# EAGLE design DCDCDC (EAGLE 9.1.3)
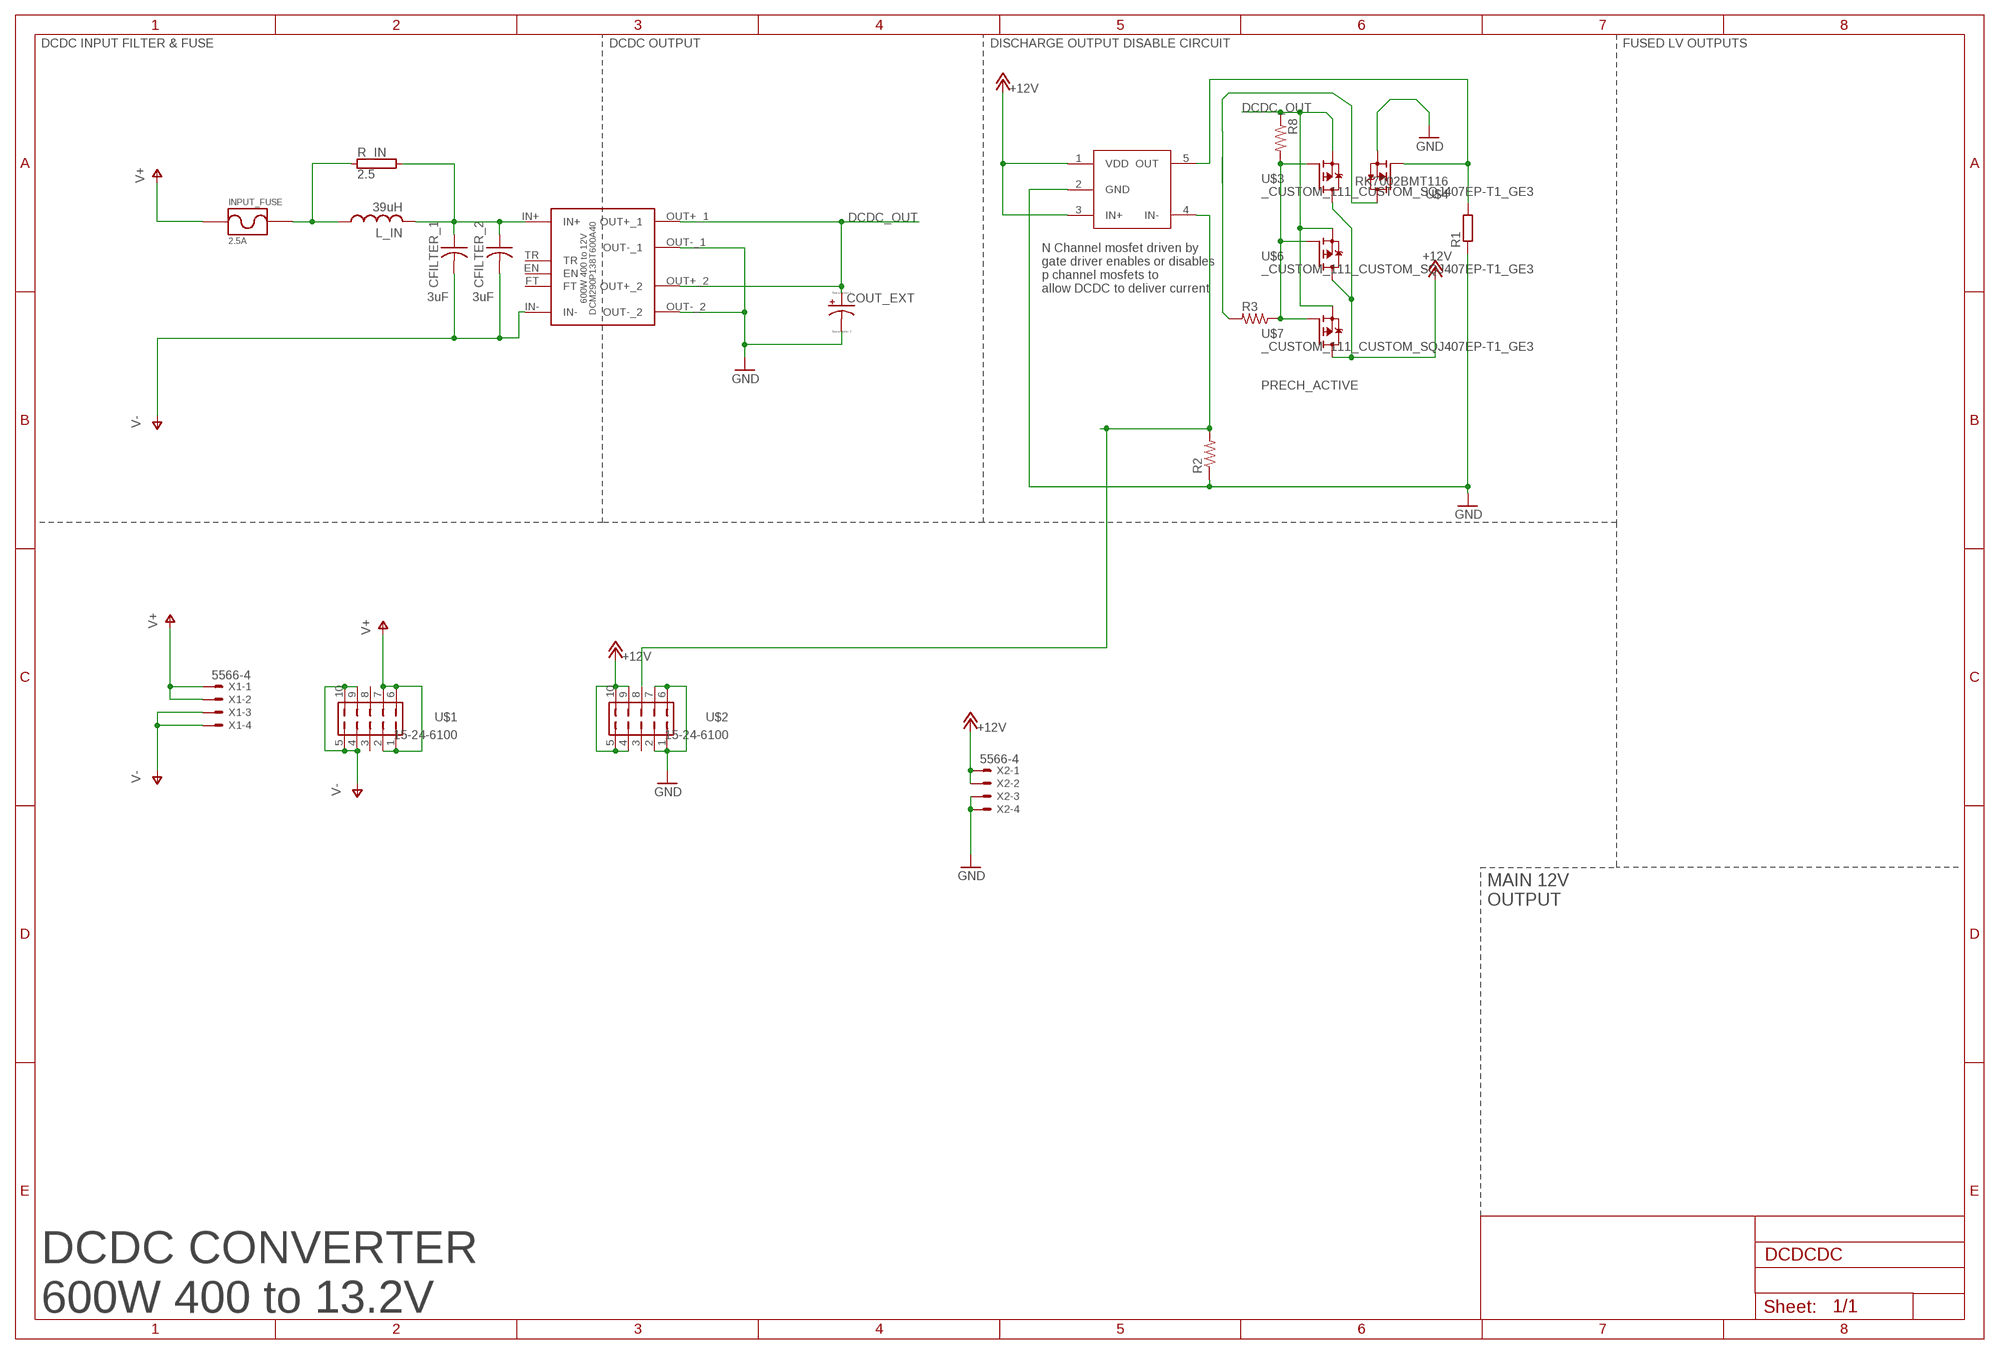
[diagram p0: schematic, sheet 1]

## Parts
CFILTER_1  3uF  B58035U5305M062  [CERALINK_FA3]
CFILTER_2  3uF  B58035U5305M062  [CERALINK_FA3]
COUT_EXT  CPOL-USE7.5-16  [E7,5-16]
DCM290P138T600A40  600W 400 to 12V  VICOR_CHIP_WITH_HEATSINK  [VICOR_CHIP_HEATSINK]
INPUT_FUSE  2.5A  _CUSTOM_PARTS_LF_885  [_CUSTOM_PARTS_LF_885]
L_IN  39uH  SRP1770TA-390M  [L_1510_NONSTANDARD]
R1  R-EU_R0805  [R0805]
R2  R-US_R0805  [R0805]
R3  R-US_R0805  [R0805]
R8  R-US_R0805  [R0805]
R_IN  2.5  RMG100-V  [TO-247-2V]
U$1  15-24-6100  [15-24-6100]
U$2  15-24-6100  [15-24-6100]
U$3  _CUSTOM_111_CUSTOM_SQJ407EP-T1_GE3  [_CUSTOM_111_CUSTOM_TRANS_SIRA90DP-T1-GE3]
U$4  RK7002BMT116  [SOT23]
U$5  UCC27511AQDBVRQ1  [SOT23-5L]
U$6  _CUSTOM_111_CUSTOM_SQJ407EP-T1_GE3  [_CUSTOM_111_CUSTOM_TRANS_SIRA90DP-T1-GE3]
U$7  _CUSTOM_111_CUSTOM_SQJ407EP-T1_GE3  [_CUSTOM_111_CUSTOM_TRANS_SIRA90DP-T1-GE3]
X1  5566-4  [5566-4]
X2  5566-4  [5566-4]

## Nets
+12V: U$2.4 U$2.5 U$2.9 U$2.10 U$3.5(D) U$5.1(VDD) U$5.3(IN+) U$6.5(D) U$7.5(D) X2.1 X2.2
DCDC_OUT: COUT_EXT.+ DCM290P138T600A40.OUT+_1 DCM290P138T600A40.OUT+_2 R8.1 U$3.1(S) U$3.2(S) U$3.3(S) U$6.1(S) U$6.2(S) U$6.3(S) U$7.1(S) U$7.2(S) U$7.3(S)
GND: COUT_EXT.- DCM290P138T600A40.OUT-_1 DCM290P138T600A40.OUT-_2 R1.1 R2.1 U$2.1 U$2.2 U$2.6 U$2.7 U$4.2(S) U$5.2(GND) X2.3 X2.4
N$1: R3.1 R8.2 U$3.4(G) U$6.4(G) U$7.4(G)
N$2: R1.2 U$4.1(G) U$5.5(OUT)
N$3 [LV]: CFILTER_1.P$1 CFILTER_2.P$1 DCM290P138T600A40.IN+ L_IN.P$2 R_IN.2
N$4: R3.2 U$4.3(D)
PRECH_ACTIVE: R2.2 U$2.8 U$5.4(IN-)
V+ [LV]: INPUT_FUSE.P$1 U$1.1 U$1.2 U$1.6 U$1.7 X1.1 X1.2
V+_FUSED [LV]: INPUT_FUSE.P$2 L_IN.P$1 R_IN.1
V- [LV]: CFILTER_1.P$2 CFILTER_2.P$2 DCM290P138T600A40.IN- U$1.4 U$1.5 U$1.9 U$1.10 X1.3 X1.4
Unconnected: DCM290P138T600A40.EN DCM290P138T600A40.FT DCM290P138T600A40.TR U$1.3 U$1.8 U$2.3

## Notes on the sheet
- DCDC INPUT FILTER & FUSE | DCDC OUTPUT | DISCHARGE OUTPUT DISABLE CIRCUIT | FUSED LV OUTPUTS
- N Channel mosfet driven by 
  gate driver enables or disables 
  p channel mosfets to 
  allow DCDC to deliver current
- MAIN 12V
  OUTPUT
- DCDC CONVERTER 
  600W 400 to 13.2V

## Library data of the parts
CFILTER_1 CFILTER_2 = ACC-MB-R0:B58035U5305M062
COUT_EXT = ACC-MB-R0:CPOL-US: POLARIZED CAPACITOR, American symbol
DCM290P138T600A40 = ACC-MB-R0:VICOR_CHIP_WITH_HEATSINK
INPUT_FUSE = ACC-MB-R0:_CUSTOM_PARTS_LF_885
L_IN = ACC-MB-R0:SRP1770TA-390M
R1 = ACC-MB-R0:R-EU_: RESISTOR, European symbol; SPICEPREFIX: R
R2 R3 R8 = ACC-MB-R0:R-US_: RESISTOR, American symbol; SPICEPREFIX: R
R_IN = ACC-MB-R0:RMG100: TO-247 Power Resistor - RMG 100 Series Source: www.token.com.tw .. power-resistor-rmg100pdf; OC_FARNELL: unknown; OC_NEWARK: unknown
U$1 U$2 = ACC-MB-R0:15-24-6100
U$3 U$6 U$7 = ACC-MB-R0:_CUSTOM_111_CUSTOM_SQJ407EP-T1_GE3
U$4 = ACC-MB-R0:RK7002BMT116
U$5 = ACC-MB-R0:UCC27511AQDBVRQ1
X1 X2 = ACC-MB-R0:5566-4: Mini FIT connector 4 pol Source: http://www.molex.com; MF: MOLEX; OC_FARNELL: unknown; OC_NEWARK: unknown

## Net classes
0 default: width 1 mm, clearance 0.152 mm
1 LV: clearance 0.001 mm

## Board
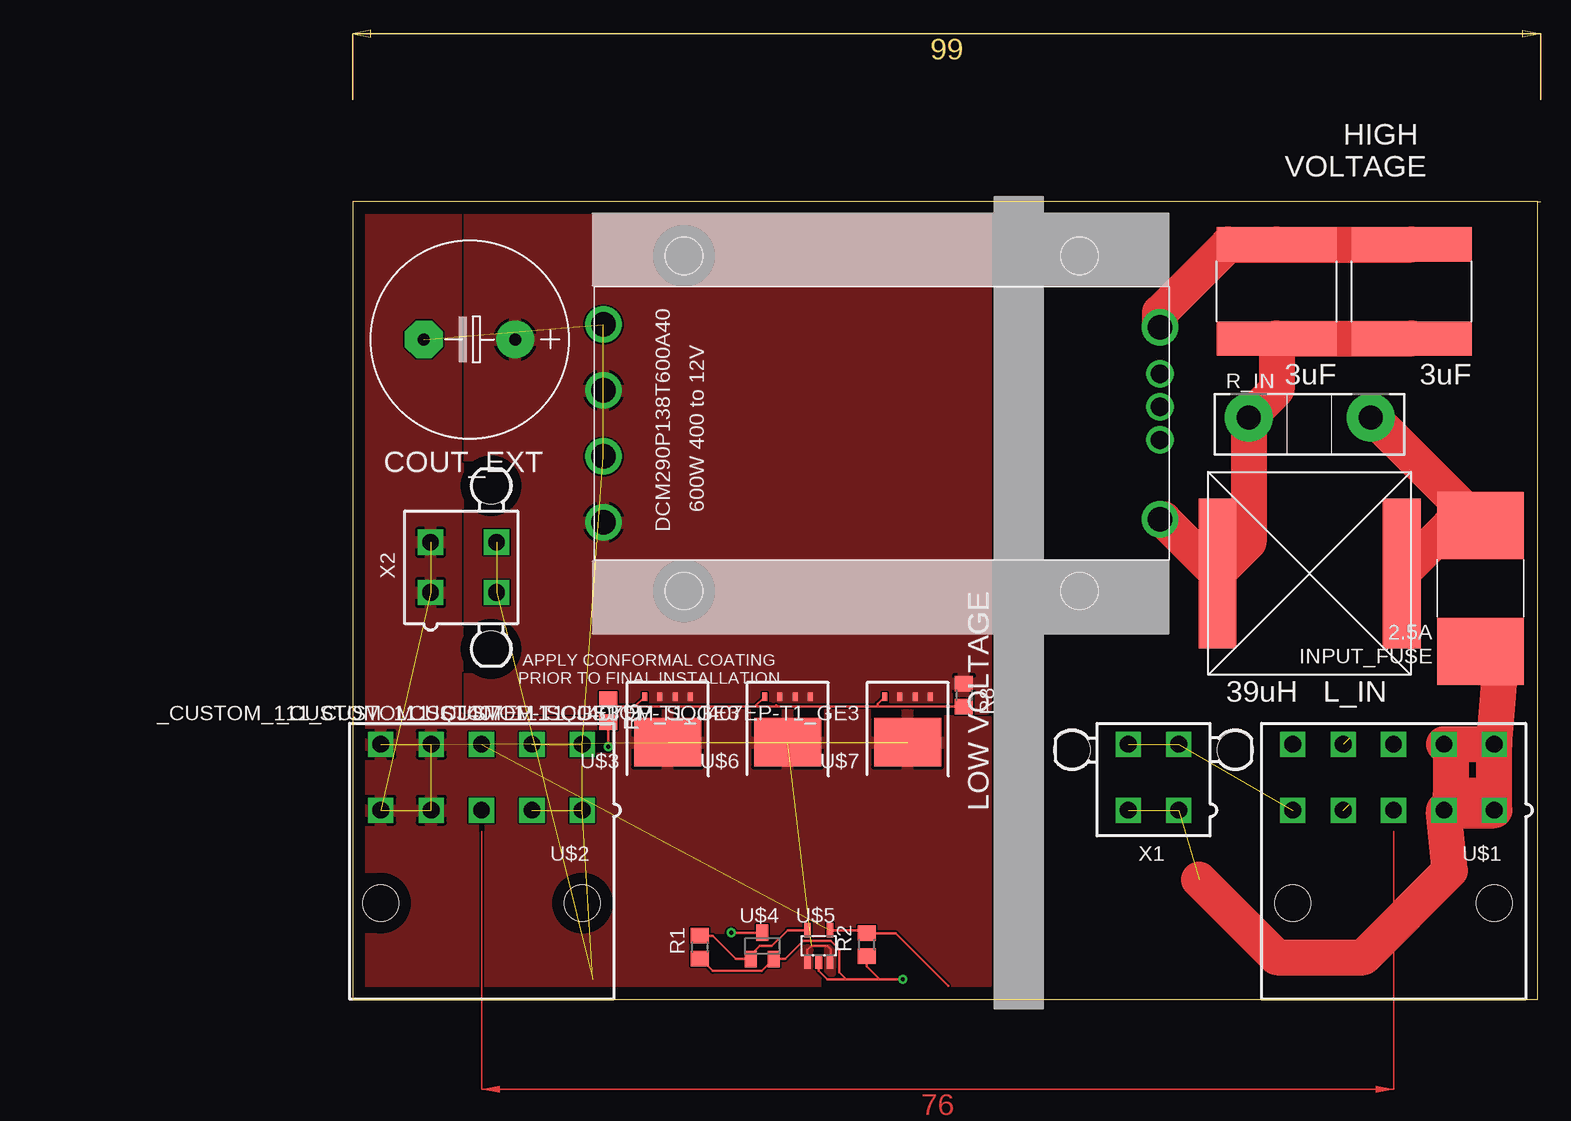
[diagram p1: board, top side]
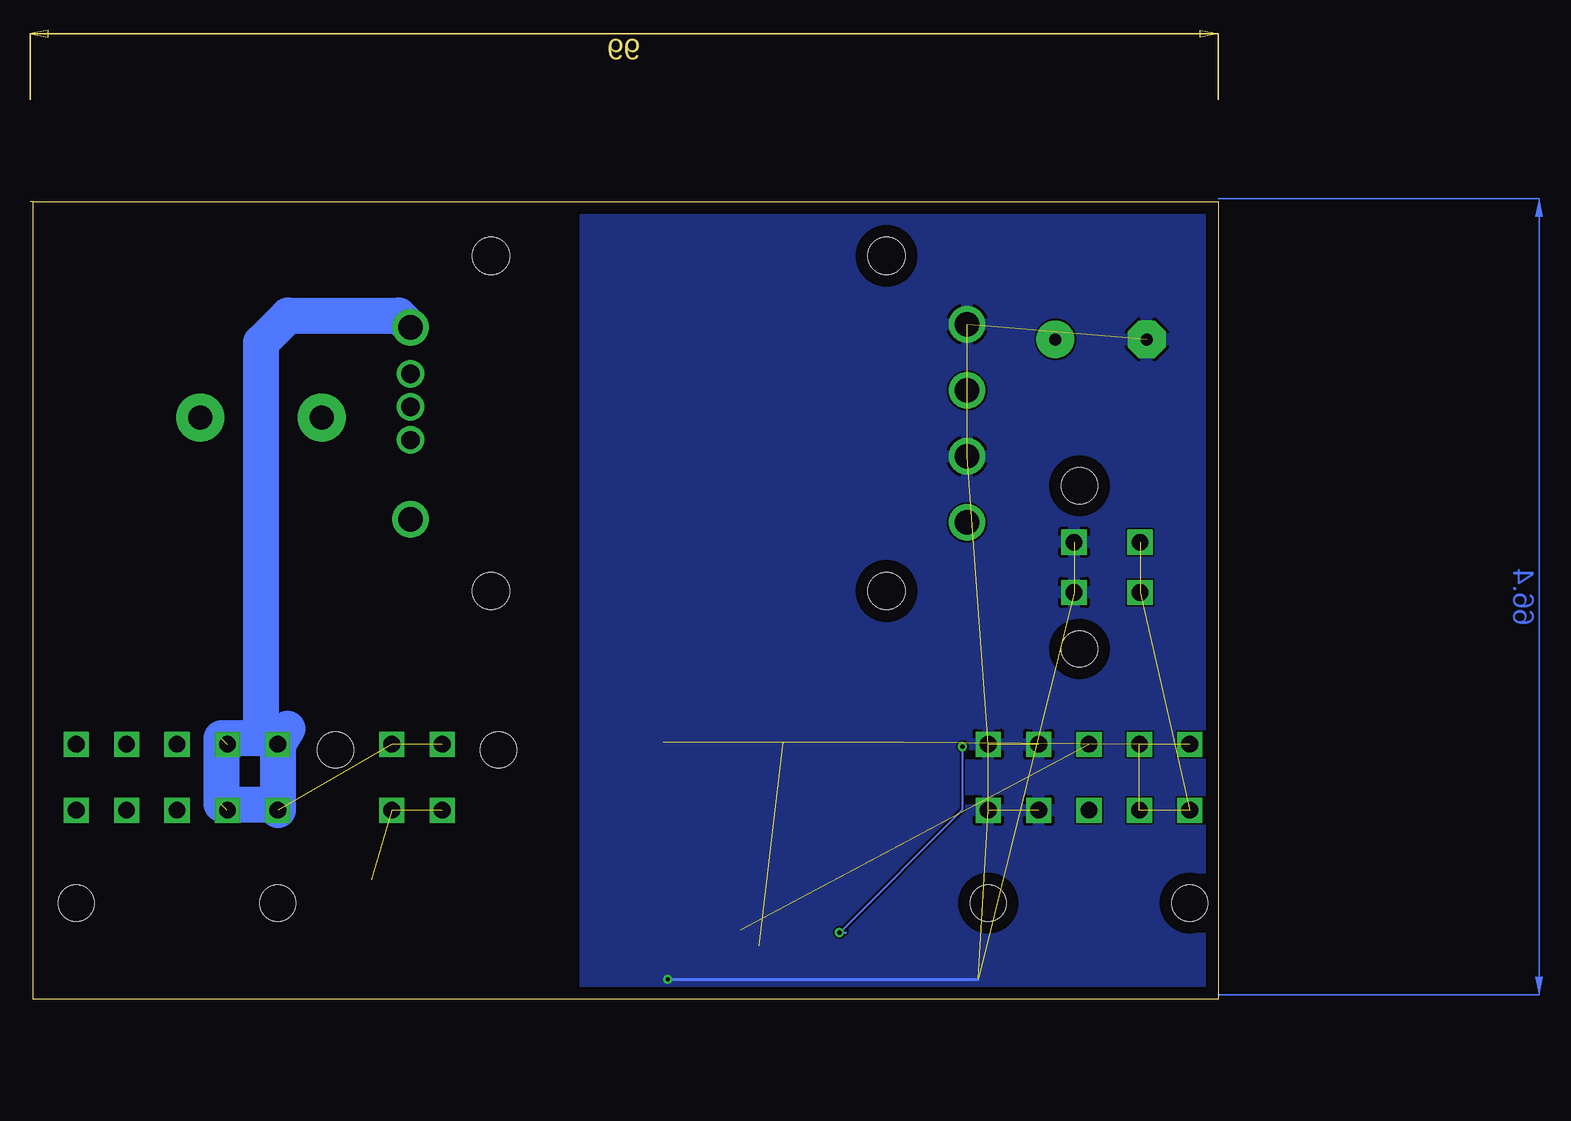
[diagram p2: board, bottom side, seen from below]

Size 99 x 66.5 mm. Coordinates in mm from the lower left corner, seen from the top.
Outline: 98.75,66.5 0,66.5 0,0 98.75,0 98.75,66.5
Outline: 98.75,66.5 99,66.5
Copper layers (1*16): Top 0.035mm / dielectric 1.5mm / Bottom 0.035mm
Design rules "default": minimum track width 6mil, minimum drill 0.35mm, track to track 6mil, track to pad 6mil, pad to pad 6mil, via to via 6mil, smd to smd 6mil, copper to edge 40mil, drill to drill 6mil, minimum pad ring 10mil, minimum via ring 8mil, stop-mask expansion 4mil, vias tented up to drill 0mil, thermal gap 10mil

### Footprints (pad centres in the part's own frame; a part is rotated, then mirrored left to right if it is on the bottom)
CERALINK_FA3 = smd 2.85 x 10: P$1 -3.925,0; P$2 3.925,0
E7,5-16 = drill 1.016 pad 3.15: + -3.81,0 | drill 1.016 pad 3.15 octagon: - 3.81,0
VICOR_CHIP_HEATSINK = drill 1.52 pad 1.77: EN -23.19,-1.38; FT -23.19,-4.13; TR -23.19,1.38 | drill 2.03 pad 2.28: IN+ -23.19,8; IN- -23.19,-8 | drill 2.03 pad 2.41: OUT+_1 23.19,8.25; OUT+_2 23.19,-2.75; OUT-_1 23.19,2.75; OUT-_2 23.19,-8.25 | hole 3.1: -16.47,13.97; -16.47,-13.97; 16.47,13.97; 16.47,-13.97
_CUSTOM_PARTS_LF_885 = smd 5.6 x 7.23: P$1 5.25,0; P$2 -5.25,0
L_1510_NONSTANDARD = smd 3.15 x 12.5: P$1 -7.675,0; P$2 7.675,0
R0805 = smd 1.3 x 1.5: 1 -0.95,0; 2 0.95,0
TO-247-2V = drill 2 pad 4: 1 -5.08,0; 2 5.08,0
15-24-6100 = drill 1.4 square: 1 8.4,-2.75; 2 4.2,-2.75; 3 0,-2.75; 4 -4.2,-2.75; 5 -8.4,-2.75; 6 8.4,2.75; 7 4.2,2.75; 8 0,2.75; 9 -4.2,2.75; 10 -8.4,2.75 | hole 3: 8.4,-10.5; -8.4,-10.5
_CUSTOM_111_CUSTOM_TRANS_SIRA90DP-T1-GE3 = smd 0.41 x 0.72: 1 -1.905,-2.715; 2 -0.635,-2.715; 3 0.635,-2.715; 4 1.905,-2.715 | smd 5.588 x 4.064: 5 0,1.08
SOT23 = smd 1 x 1.4: 1 -0.95,-1.1; 2 0.95,-1.1; 3 0,1.1
SOT23-5L = smd 0.55 x 1.2: 1 -0.95,-1.3; 2 0,-1.3; 3 0.95,-1.3; 4 0.95,1.3; 5 -0.95,1.3
5566-4 = drill 1.4 square: 1 2.1,-2.75; 2 -2.1,-2.75; 3 2.1,2.75; 4 -2.1,2.75 | hole 3: 6.8,2.29; -6.8,2.29

### Placement (x,y rotation side)
CFILTER_1  88.25,59 90 top
CFILTER_2  77,59 90 top
COUT_EXT  9.75,55 180 top
DCM290P138T600A40  44.1,48 180 top
INPUT_FUSE  94,34.25 270 top
L_IN  79.75,35.5 180 top
R1  28.95,4.35 90 top
R2  42.85,4.55 90 top
R3  21.3,24.05 270 top
R8  50.95,25.35 270 top
R_IN  79.75,48.5 180 top
U$1  86.75,18.5 0 top
U$2  10.75,18.5 0 top
U$3  26.25,22.5 180 top
U$4  34.15,4.45 0 top
U$5  38.85,4.45 0 top
U$6  36.25,22.5 180 top
U$7  46.25,22.5 180 top
X1  66.75,18.5 0 top
X2  9.25,36 270 top

### Tracks (layer width: path | path; a pad name or v marks a point on that pad's centre or on a via)
+12V  (9 unrouted)
  Top 0.2: U$5.1 37.9,4.1 38.25,4.45 39.55,4.45 39.85,4.15 39.85,3.2 U$5.3
  pour Top (rank 2): 0,0.35 52.75,0.35 52.75,24.25 9.75,24.25 9.75,66.75 0,66.75
DCDC_OUT
  pour Top: 52.75,24.2 9.75,24.2 9.75,66.5 52.75,66.5
GND  (via drill 0.35)  (9 unrouted)
  Top 0.2: U$5.2 38.85,2.35 39.55,1.65 41.15,1.65 | 41.15,1.65 40.55,2.25 40.55,4.15 39.85,4.85 37.55,4.85 36.05,3.35 U$4.2 34.1,2.35 30,2.35 R1.1 | 41.15,1.65 43.95,1.65 | R2.1 42.85,2.75 43.95,1.65 | 43.95,1.65 45.75,1.65
  Top 0.254: 45.75,1.65 v45.85,1.65
  Bottom 0.254: v45.85,1.65 20,1.65
  pour Bottom: 52.75,1 0,1 0,66.25 52.75,66.25
N$1
  Top 0.2: R8.2 46.41,24.4 43.75,24.4 35.41,24.4 | 35.41,24.4 35.3,24.5 | 35.41,24.4 33.5,24.4 24.41,24.4 23.5,24.4 21.9,24.4 R3.1
  Top 0.203: U$7.4 43.75,24.62 43.75,24.4 | U$6.4 33.53,24.4 33.5,24.4 | U$3.4 23.53,24.4 23.5,24.4
N$2
  Top 0.2: U$5.5 36.25,5.75 34.95,4.45 33.95,4.45 33.2,3.7 U$4.1 31.95,3.35 30,5.3 R1.2
N$3
  Top 1: 74.36,55.08 CFILTER_2.P$1
  Top 2.54: 76.67,54.75 CFILTER_2.P$1
  Top 3: CFILTER_1.P$1 CFILTER_2.P$1 77,50.83 R_IN.2 74.67,38.09 L_IN.P$2 67.58,40 DCM290P138T600A40.IN+
N$4  (via drill 0.35)
  Top 0.2: v31.55,5.55 U$4.3 | R3.2 v21.3,21.05
  Bottom 0.152: v31.54,5.55 21.3,15.79 v21.3,21.05
  Bottom 0.2: v31.55,5.55 v31.54,5.55 31.04,5.55
PRECH_ACTIVE  (1 unrouted)
  Top 0.2: U$5.4 42.6,5.75 R2.2 45.25,5.5 49.62,1.12
V+  (2 unrouted)
  Top 3: U$1.1 U$1.2 91.45,10.7 84.25,3.5 77,3.5 70.55,9.95 | U$1.1 U$1.6 | U$1.6 U$1.7 91.5,21.2 91.5,17 94.4,17 U$1.1 | U$1.6 95.65,27.35 INPUT_FUSE.P$1
V+_FUSED
  Top 3: L_IN.P$1 91.42,39.5 INPUT_FUSE.P$2 85,48.5 R_IN.1
V-  (4 unrouted)
  Top 1: 75.33,62.92 CFILTER_2.P$2
  Top 3: CFILTER_1.P$2 CFILTER_2.P$2 72.97,62.92 67.29,57.25 DCM290P138T600A40.IN-
  Bottom 3: 78.85,16.25 83.05,16.25 83.05,21.75 79.35,21.75 U$1.10 | DCM290P138T600A40.IN- 68.29,57 77.5,57 79.75,54.75 79.75,22.15 U$1.10 | U$1.10 U$1.5 | 77.55,22.55 U$1.10
(copper drawn outside any net)
  shapes: Bottom area x1, Top area x1

### Text on the board
tPlace: HIGH / VOLTAGE | HIGH / VOLTAGE | LOW VOLTAGE | APPLY CONFORMAL COATING / PRIOR TO FINAL INSTALLATION